# EAGLE design matrixkey-adapter (EAGLE 6.6.0)
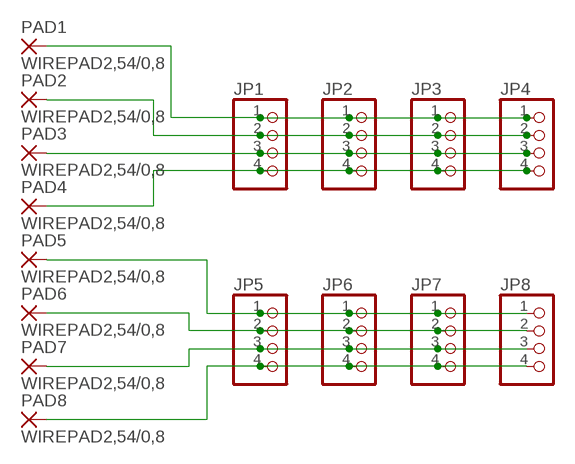
[diagram p0: schematic, sheet 1]

## Parts
JP1  PINHD-1X4  [1X04]
JP2  PINHD-1X4  [1X04]
JP3  PINHD-1X4  [1X04]
JP4  PINHD-1X4  [1X04]
JP5  PINHD-1X4  [1X04]
JP6  PINHD-1X4  [1X04]
JP7  PINHD-1X4  [1X04]
JP8  PINHD-1X4  [1X04]
PAD1  WIREPAD2,54/0,8  [2,54/0,8]
PAD2  WIREPAD2,54/0,8  [2,54/0,8]
PAD3  WIREPAD2,54/0,8  [2,54/0,8]
PAD4  WIREPAD2,54/0,8  [2,54/0,8]
PAD5  WIREPAD2,54/0,8  [2,54/0,8]
PAD6  WIREPAD2,54/0,8  [2,54/0,8]
PAD7  WIREPAD2,54/0,8  [2,54/0,8]
PAD8  WIREPAD2,54/0,8  [2,54/0,8]

## Nets
N$1: JP1.1 JP2.1 JP3.1 JP4.1 PAD1.1(P)
N$2: JP1.2 JP2.2 JP3.2 JP4.2 PAD2.1(P)
N$3: JP1.3 JP2.3 JP3.3 JP4.3 PAD3.1(P)
N$4: JP1.4 JP2.4 JP3.4 JP4.4 PAD4.1(P)
N$5: JP5.1 JP6.1 JP7.1 JP8.1 PAD5.1(P)
N$6: JP5.2 JP6.2 JP7.2 JP8.2 PAD6.1(P)
N$7: JP5.3 JP6.3 JP7.3 JP8.3 PAD7.1(P)
N$8: JP5.4 JP6.4 JP7.4 JP8.4 PAD8.1(P)

## Library data of the parts
JP1-JP8 = pinhead:PINHD-1X4: PIN HEADER
PAD1-PAD8 = wirepad:WIREPAD: Wire PAD connect wire on PCB

## Board
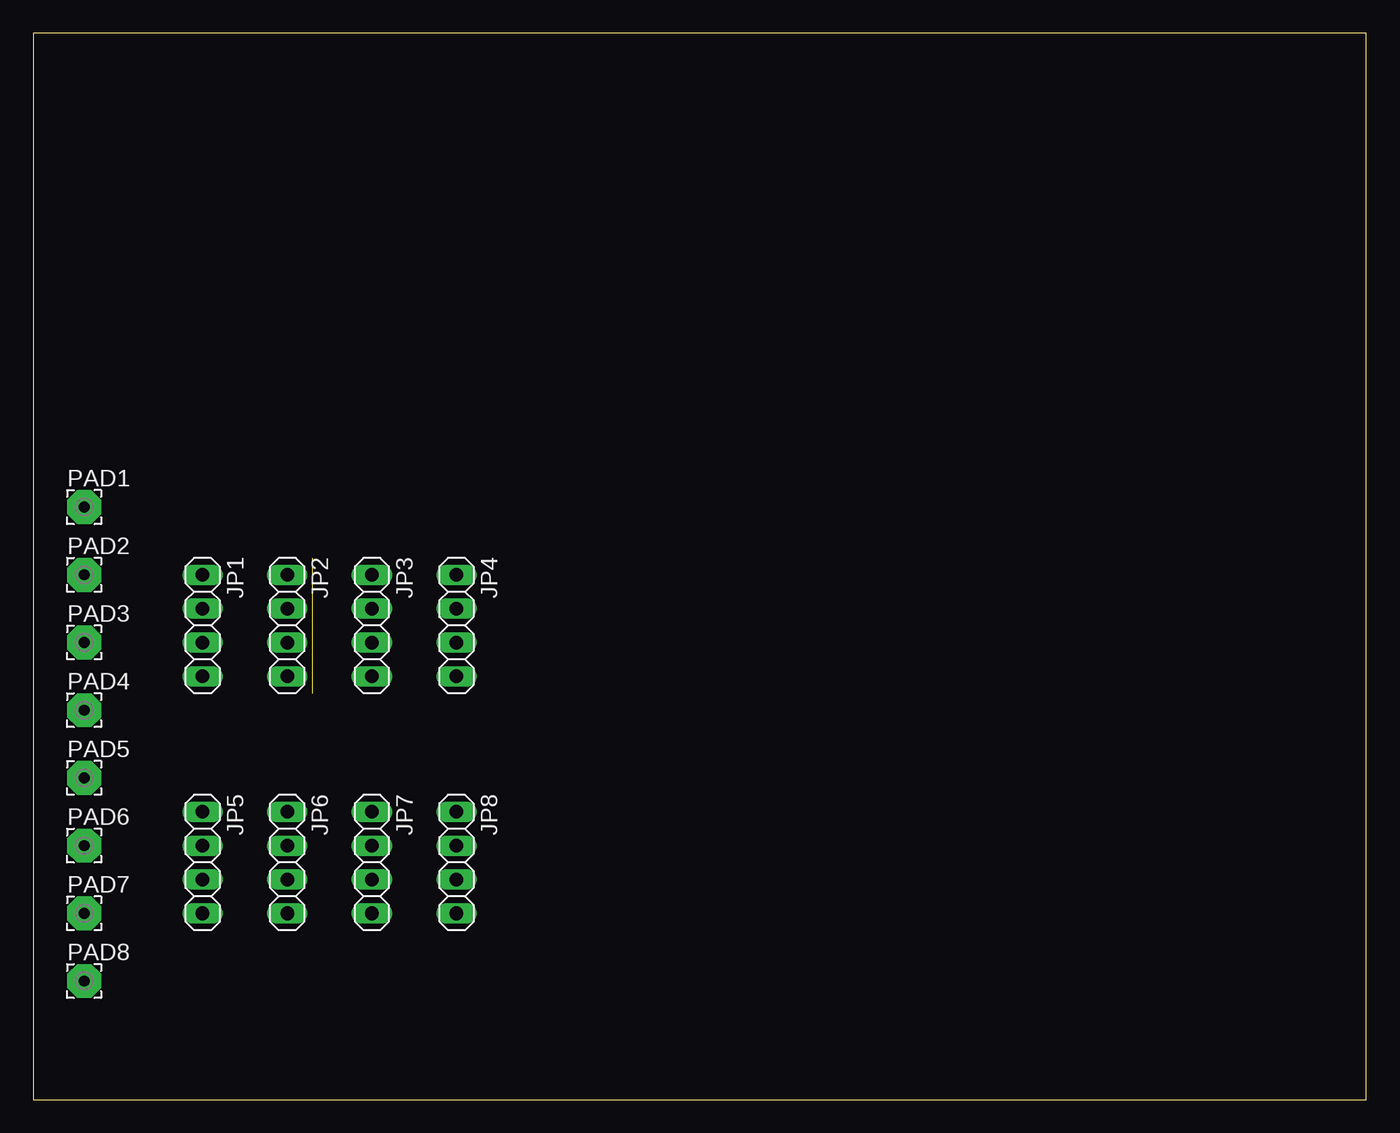
[diagram p1: board, top side]
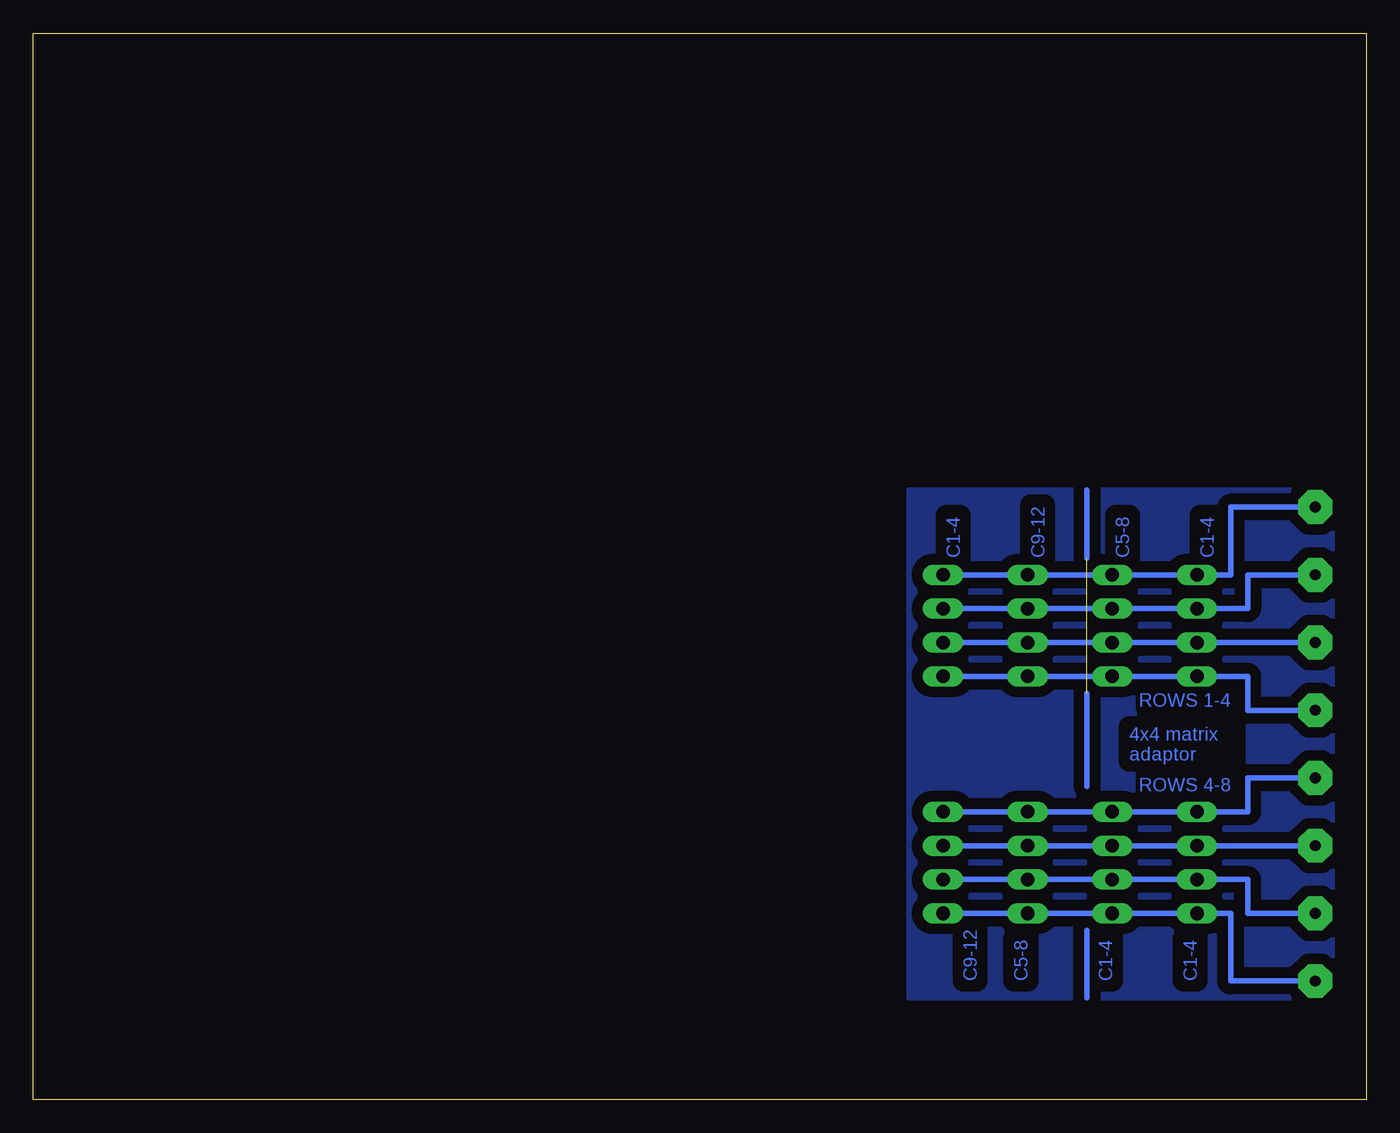
[diagram p2: board, bottom side, seen from below]

Size 100 x 80 mm. Coordinates in mm from the lower left corner, seen from the top.
Outline: 0,0 100,0 100,80 0,80 0,0
Copper layers (1*16): Top 0.035mm / dielectric 1.5mm / Bottom 0.035mm
Design rules "default": minimum track width 10mil, minimum drill 24mil, track to track 8mil, track to pad 8mil, pad to pad 8mil, via to via 8mil, smd to smd 8mil, copper to edge 40mil, drill to drill 8mil, minimum pad ring 10mil, minimum via ring 8mil, stop-mask expansion 4mil, vias tented up to drill 0mil, thermal gap 10mil

### Footprints (pad centres in the part's own frame; a part is rotated, then mirrored left to right if it is on the bottom)
1X04 = drill 1.016 long: 1 -3.81,0; 2 -1.27,0; 3 1.27,0; 4 3.81,0
2,54/0,8 = drill 0.813 pad 2.54 octagon: 1 0,0

### Placement (x,y rotation side)
JP1  12.7,35.56 270 top
JP2  19.05,35.56 270 top
JP3  25.4,35.56 270 top
JP4  31.75,35.56 270 top
JP5  12.7,17.78 270 top
JP6  19.05,17.78 270 top
JP7  25.4,17.78 270 top
JP8  31.75,17.78 270 top
PAD1  3.81,44.45 0 top
PAD2  3.81,39.37 0 top
PAD3  3.81,34.29 0 top
PAD4  3.81,29.21 0 top
PAD5  3.81,24.13 0 top
PAD6  3.81,19.05 0 top
PAD7  3.81,13.97 0 top
PAD8  3.81,8.89 0 top

### Tracks (layer width: path | path; a pad name or v marks a point on that pad's centre or on a via)
N$1
  Bottom 0.406: PAD1.1 10.16,44.45 10.16,39.37 JP1.1 JP2.1 JP3.1 JP4.1
N$2
  Bottom 0.406: PAD2.1 8.89,39.37 8.89,36.83 JP1.2 JP2.2 JP3.2 JP4.2
N$3
  Bottom 0.406: PAD3.1 JP1.3 JP2.3 JP3.3 JP4.3
N$4
  Bottom 0.406: PAD4.1 8.89,29.21 8.89,31.75 JP1.4 JP2.4 JP3.4 JP4.4
N$5
  Bottom 0.406: PAD5.1 8.89,24.13 8.89,21.59 JP5.1 JP6.1 JP7.1 JP8.1
N$6
  Bottom 0.406: PAD6.1 JP5.2 JP6.2 JP7.2 JP8.2
N$7
  Bottom 0.406: PAD7.1 8.89,13.97 8.89,16.51 JP5.3 JP6.3 JP7.3 JP8.3
N$8
  Bottom 0.406: PAD8.1 10.16,8.89 10.16,13.97 JP5.4 JP6.4 JP7.4 JP8.4
N$9
  pour Bottom (isolate 0.813): 2.54,45.72 34.29,45.72 34.29,7.62 2.54,7.62
N$10  (1 unrouted)
  Bottom 0.406: 20.95,45.72 20.95,40.64 | 20.95,30.48 20.95,23.5
N$11
  Bottom 0.406: 20.95,7.62 20.95,12.7

### Text on the board
Bottom: C1-4 | C5-8 | C9-12 | C1-4 | ROWS 1-4 | 4x4 matrix / adaptor | ROWS 4-8 | C1-4 | C1-4 | C5-8 | C9-12